# EAGLE design bike-blinky (EAGLE 6.4)
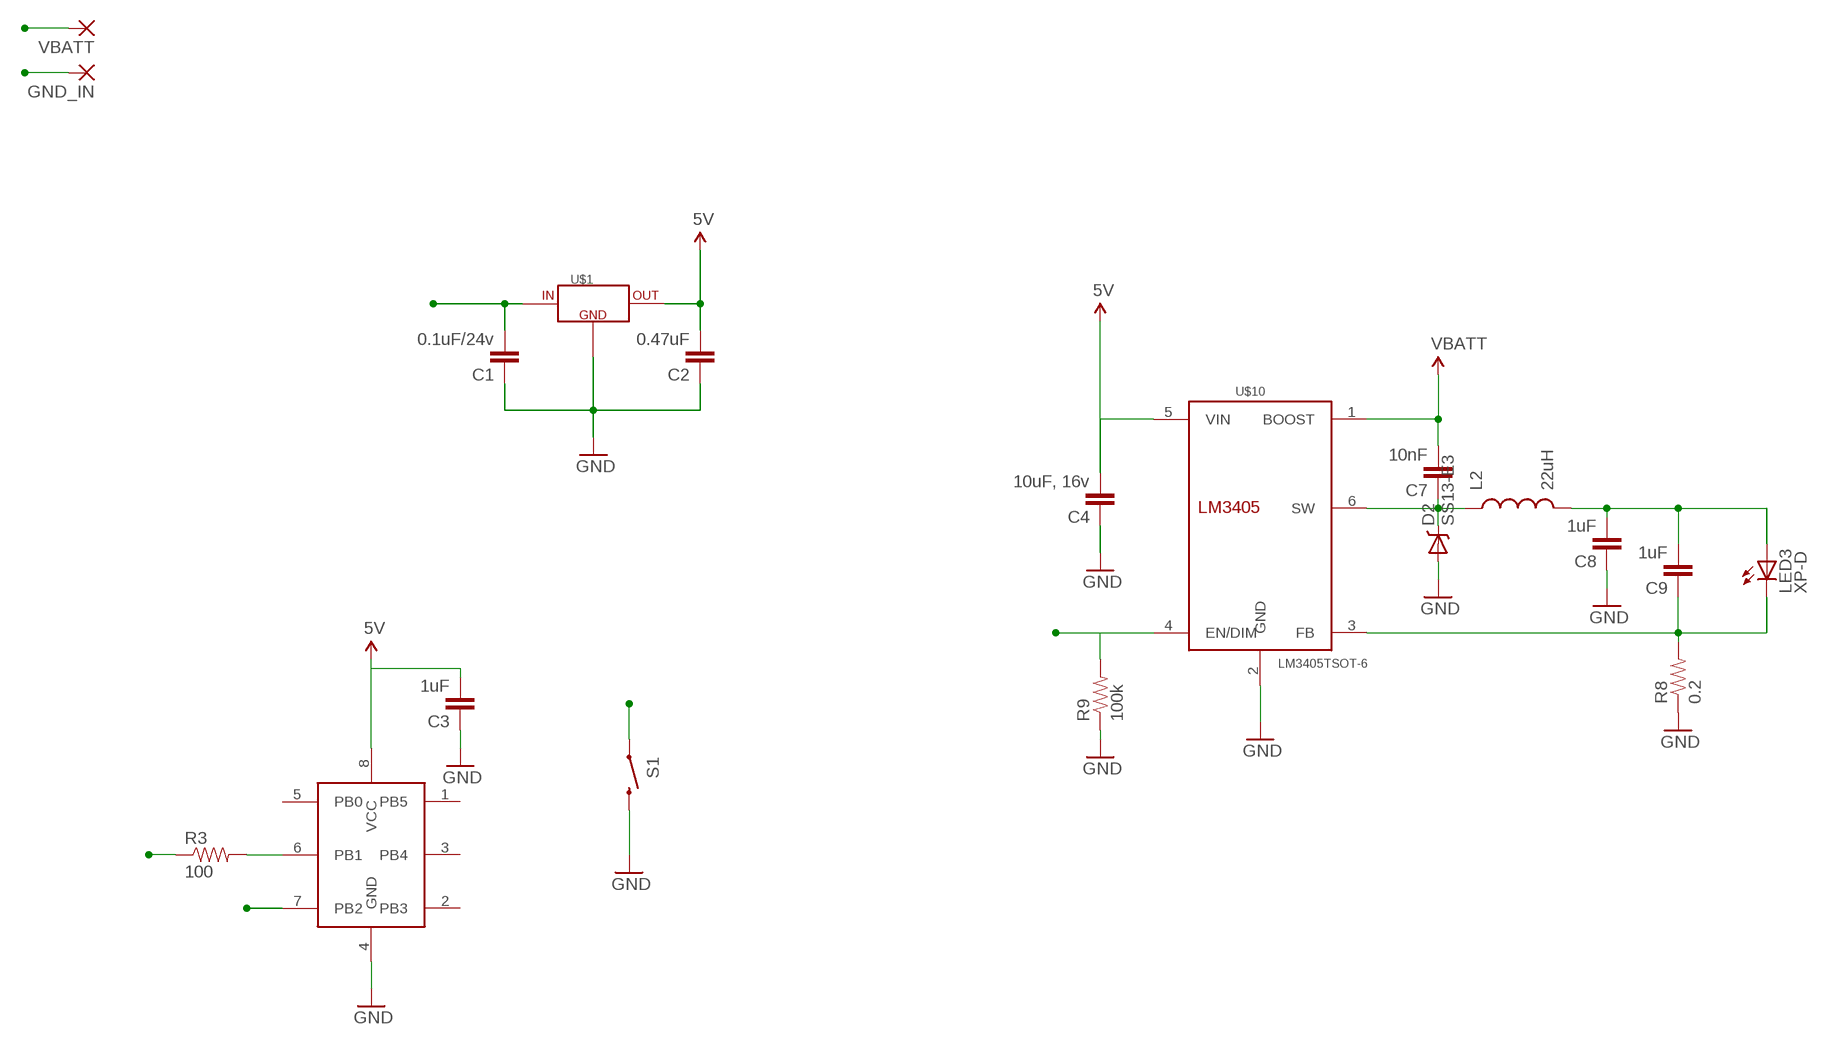
[diagram p0: schematic, sheet 1]

## Parts
C1  0.1uF/24v  CAP0603-CAP  [0603-CAP]
C2  0.47uF  CAP0603-CAP  [0603-CAP]
C3  1uF  CAP0603-CAP  [0603-CAP]
C4  10uF, 16v  CAP1206  [1206]
C7  10nF  CAP1206  [1206]
C8  1uF  CAP1206  [1206]
C9  1uF  CAP1206  [1206]
D2  SS13-E3  MBRA140  [SMA-DIODE]
GND_IN  WIREPAD2,54/1,0  [2,54/1,0]
L2  22uH  INDUCTOR1210  [1210]
LED3  XP-D  XLAMP-XB-D-LED  [XB-D-REV1]
R3  100  RESISTOR0603-RES  [0603-RES]
R8  0.2  RESISTOR2010  [R2010]
R9  100k  RESISTOR0603-RES  [0603-RES]
S1  SWITCH-MOMENTARY-2SMD-2  [TACTILE_SWITCH_SMD-2]
U$1  TPS715XX  [SC70-5]
U$2  ATTINY13  [WSOIC-8]
U$10  LM3405TSOT-6  [TSOT-6]
VBATT  WIREPAD2,54/1,0  [2,54/1,0]

## Nets
5V: C2.2 C3.2 C4.2 U$1.5(OUT) U$2.8(VCC) U$10.5(VIN)
GND: C1.1 C2.1 C3.1 C4.1 C8.1 D2.A GND_IN.1(P) R8.1 R9.1 S1.1 U$1.2(GND) U$2.4(GND) U$10.2(GND)
N$2: R3.2 U$2.6(PB1)
N$8: C9.1 LED3.C R8.2 U$10.3(FB)
N$12: C7.1 D2.C L2.1 U$10.6(SW)
N$13: C8.2 C9.2 L2.2 LED3.A
RED: R3.1 R9.2 U$10.4(EN/DIM)
SW: S1.2 U$2.7(PB2)
VBATT: C1.2 C7.2 U$1.4(IN) U$10.1(BOOST) VBATT.1(P)
Unconnected: U$2.1(PB5) U$2.2(PB3) U$2.3(PB4) U$2.5(PB0)

## Library data of the parts
C1-C4 = SparkFun:CAP: Capacitor Standard 0603 ceramic capacitor, and 0.1" leaded capacitor.
C7-C9 = SparkFun-Capacitors:CAP: Capacitor Standard 0603 ceramic capacitor, and 0.1" leaded capacitor.
D2 = SparkFun-DiscreteSemi:MBRA140: 40V, 1A Schottky rectifier SMA/DO-214AC package DIO-08053; PROD_ID: DIO-08053
GND_IN VBATT = wirepad:WIREPAD: Wire PAD connect wire on PCB
L2 = SparkFun-Passives:INDUCTOR: Inductors Basic Inductor/Choke - 0603 and 1206. Footprints are not proven and vary greatly between part numbers.
LED3 = led_cree:XLAMP-XB-D-LED
R3 = SparkFun:RESISTOR: Resistor Basic schematic elements and footprints for 0603, 1206, and PTH resistors.
R8 R9 = SparkFun-Passives:RESISTOR: Resistor Basic schematic elements and footprints for 0603, 1206, and PTH resistors.
S1 = SparkFun-Electromechanical:SWITCH-MOMENTARY-2: Various NO switches- pushbuttons, reed, etc
U$1 = Synapseware:TPS715XX: 50 mA, 24 V, 3.2-uA Supply Current Low-Dropout Linear Regulator in SC70 (SOT-323) Package TPS71550DCKR - 5.0V version TPS71533DCKR - 3.3V version TPS71525DCKR - 2.5V version
U$2 = Synapseware:ATTINY13
U$10 = Synapseware:LM3405: LM3405 1.6MHz, 1A Constant Current Buck Regulator for Powering LEDs

## Board
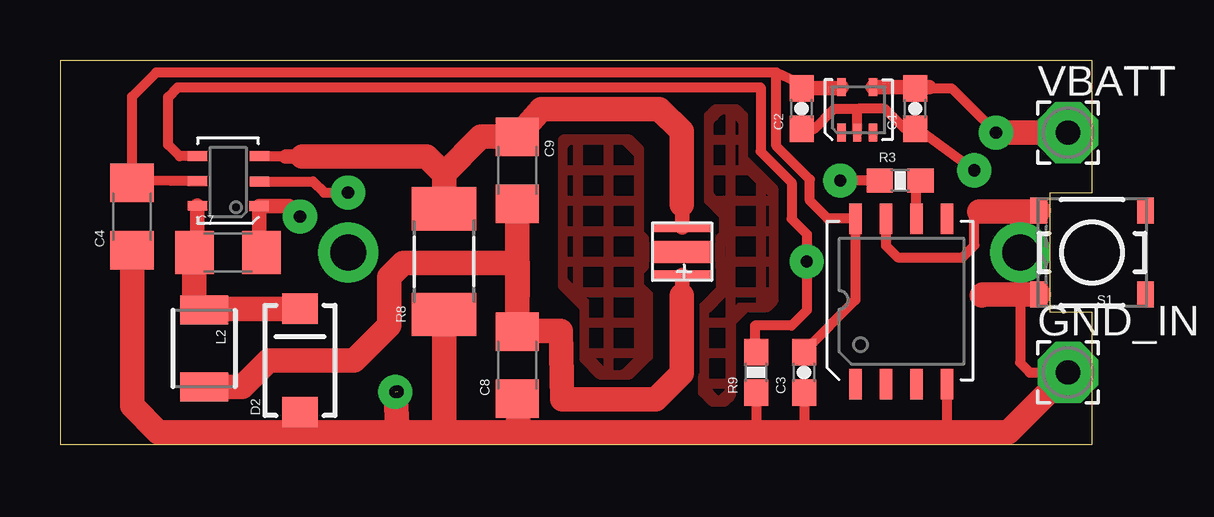
[diagram p1: board, top side]
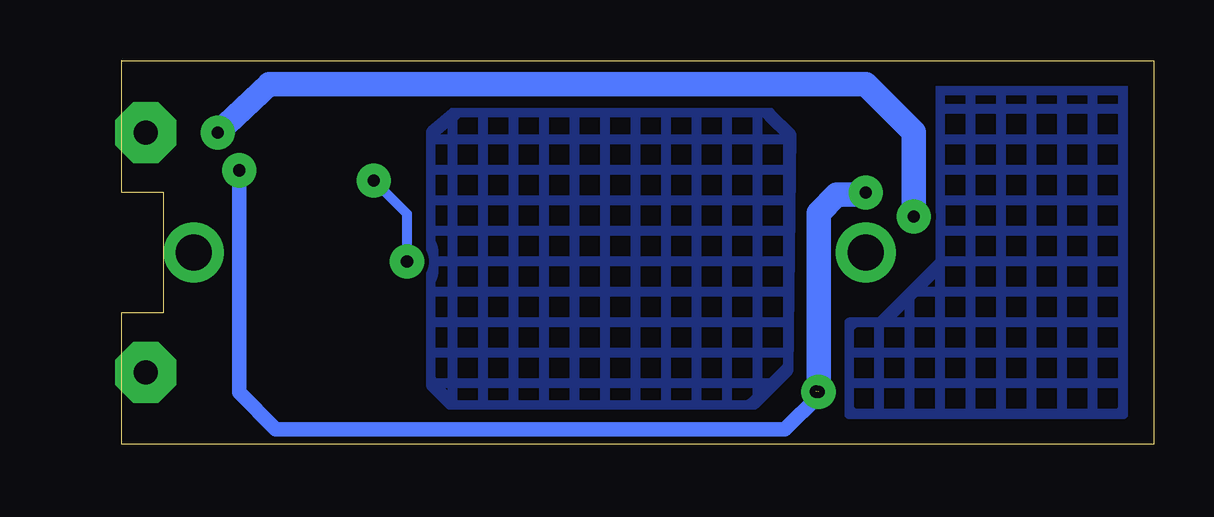
[diagram p2: board, bottom side, seen from below]

Size 43.02 x 16.01 mm. Coordinates in mm from the lower left corner, seen from the top.
Outline: 43,16 43,10.5 41.26,10.5 41.26,5.5 43,5.5 43,0 0,0 0,16 43,16
Outline: 43,16 43.02,16.01
Copper layers (1*16): Top 0.035mm / dielectric 1.5mm / Bottom 0.035mm
Design rules "default": minimum track width 10mil, minimum drill 24mil, track to track 8mil, track to pad 8mil, pad to pad 8mil, via to via 8mil, smd to smd 8mil, copper to edge 40mil, drill to drill 8mil, minimum pad ring 10mil, minimum via ring 8mil, stop-mask expansion 4mil, vias tented up to drill 0mil, thermal gap 10mil

### Footprints (pad centres in the part's own frame; a part is rotated, then mirrored left to right if it is on the bottom)
0603-CAP = smd 1.1 x 1: 1 -0.85,0; 2 0.85,0
1206 = smd 1.6 x 1.8: 1 -1.4,0; 2 1.4,0
SMA-DIODE = smd 1.27 x 1.47: A -2.15,0; C 2.15,0
2,54/1,0 = drill 1.016 pad 2.54 octagon: 1 0,0
1210 = smd 1.2 x 2: 1 -1.6,0; 2 1.6,0
XB-D-REV1 = smd 0.36 x 2.34: A 0.935,-0.075; C -1.035,-0.08 | smd 0.92 x 2.34: THERMAL -0.015,-0.075
0603-RES = smd 1.1 x 1: 1 -0.85,0; 2 0.85,0
R2010 = smd 1.8 x 2.7: 1 -2.2,0; 2 2.2,0
TACTILE_SWITCH_SMD-2 = smd 0.7 x 1.1: 1 2.225,1.75; 2 2.225,-1.75; 3 -2.225,-1.75; 4 -2.225,1.75
SC70-5 = smd 0.35 x 0.75: 1 -0.7,-1; 2 -0.05,-1; 3 0.6,-1; 4 0.6,0.9; 5 -0.7,0.9
WSOIC-8 = smd 0.508 x 1.27: 1 -1.855,-3.486; 2 -0.585,-3.486; 3 0.685,-3.486; 4 1.955,-3.486; 5 1.955,3.413; 6 0.685,3.413; 7 -0.585,3.413; 8 -1.855,3.413
TSOT-6 = smd 0.406 x 0.813: 1 -1.06,-1.3; 2 -0.04,-1.32; 3 1.02,-1.32; 4 1.02,1.27; 5 -0.02,1.27; 6 -1.05,1.28

### Placement (x,y rotation side)
C1  35.63,14 90 top
C2  30.91,14 90 top
C3  31,3 90 top
C4  3,9.5 90 top
C7  7,8 0 top
C8  19.05,3.3 90 top
C9  19.05,11.43 270 top
D2  10,3.5 90 top
GND_IN  42,3 0 top
L2  6,4 270 top
LED3  26,8 270 top
R3  35.01,11 0 top
R8  16,7.62 90 top
R9  29,3 90 top
S1  43,8 180 top
U$1  33.27,14 0 top
U$2  35,6 0 top
U$10  7,11 90 top
VBATT  42,13 0 top

### Tracks (layer width: path | path; a pad name or v marks a point on that pad's centre or on a via)
5V
  Top 0.406: U$10.5 4.62,10.98 3.4,11 C4.2 3,14.51 4,15.51 29.84,15.51 | C3.2 31,3.88 33.15,6.02 U$2.8 31.99,9.41 31.24,10.16 31.24,11.05 29.84,12.45 29.84,15.51 | 29.84,15.51 30.94,15 30.94,14.88 C2.2
  Top 0.61: C2.2 32.52,14.85 U$1.5
GND  (via drill 0.51, 0.51 pad 1.42)  (1 unrouted)
  Top 0.406: U$10.2 10.54,10.96 11,10.5 v12,10.5 | U$2.4 36.95,0.55 37,0.5 | R9.1 29,0.6 28.9,0.5 | C3.1 31,0.6 31.1,0.5 | S1.1 40.05,6.25 40,6.2 40,3.4 40.4,3 41.3,3 41.65,2.65 | C2.1 31.42,13.15 32.27,14 33.27,14 | U$1.2 33.22,13.95 33.27,14 | 33.27,14 34.37,14 35.22,13.15 C1.1 35.75,13.15 v38.1,11.43
  Top 1.016: GND_IN.1 41.65,2.65 39.5,0.5 37,0.5 31.1,0.5 28.9,0.5 19.11,0.5 | 19.11,0.5 16,0.5 | 16,0.5 14.08,0.5 | 14.08,0.5 9.95,0.5 | C8.1 19.11,0.5 | 9.95,0.5 D2.A | C4.1 3,1.6 4.1,0.5 9.95,0.5 | R8.1 16,0.5 | v13.97,2.18 14.08,0.5 | S1.1 38.45,6.25 38.4,6.2
  Bottom 0.406: v13.97,2.18 13.97,1.91
  Bottom 0.61: v38.1,11.43 38.1,2.16 36.58,0.64 15.37,0.64 13.97,2.03 v13.97,2.18
  Bottom 1.016: v13.97,2.18 13.97,9.65 13.21,10.41 12.09,10.41 v12,10.5
  other vias: 14.08,2.2
N$1  (via drill 1.5 pad 2.5)
  other vias: 40,8
N$2
  Top 0.406: U$2.6 35.69,10.81 35.5,11 R3.2
N$3
  pour Bottom (hatched): 15.24,3.05 16.64,1.65 29.34,1.65 30.1,2.41 30.1,13.08 29.21,13.84 16,13.84 15.11,12.95
N$4
  pour Bottom (hatched): 8.89,15.24 8.89,7.62 11.43,5.08 12.7,5.08 12.7,1.27 1.27,1.27 1.27,15.24
N$5
  pour Top (hatched): 20.95,12.7 20.95,6.6 21.84,5.71 21.84,3.56 22.48,2.92 23.75,2.92 24.51,3.68 24.51,6.22 24.13,6.6 24.13,7.24 24.51,7.62 24.51,8.38 24.13,8.76 24.13,12.32 23.75,12.7
N$6
  pour Top (hatched): 27.18,8.38 27.3,8.38 27.69,8.76 27.69,9.53 27.05,10.16 27.05,13.72 27.3,13.97 28.19,13.97 28.45,13.72 28.45,11.94 29.72,10.67 29.72,5.97 29.46,5.71 28.57,5.71 27.94,5.08 27.94,2.03 27.69,1.78 27.18,1.78 26.8,2.16 26.8,5.71 27.56,6.48 27.56,7.37 27.18,7.75 27.18,8.26
N$8
  Top 0.406: U$10.3 10.28,12.02 9.4,12
  Top 0.61: LED3.C 25.92,9.98 25.9,10 | 9.4,12 10.1,12
  Top 1.016: 25.9,10 25.9,13.06 24.97,13.99 20.05,13.99 C9.1 17.53,12.83 16,11.3 16,11.27 | 10.1,12 15.27,12 16,11.27 | 16,11.27 R8.2
N$11  (via drill 1.5 pad 2.5)
  other vias: 12,8
N$12
  Top 0.406: 5.72,8.12 C7.1
  Top 0.61: U$10.6 5.72,8.12
  Top 1.016: D2.C 6.05,5.65 L2.1 5.6,5.6 C7.1
N$13
  Top 0.61: LED3.A 25.93,6.22 25.9,6.2
  Top 1.016: 25.9,6.2 25.9,2.96 24.82,1.88 20.92,1.88 20.86,4.74 19.08,4.74 C8.2 | C9.2 C8.2 | L2.2 7.6,2.4 8.7,3.5 12.27,3.5 13.59,4.83 13.72,4.95 13.72,6.99 14.3,7.57 17.3,7.57 19.07,7.56 C8.2
RED  (via drill 0.51 pad 1.42)
  Top 0.406: U$10.4 4.98,12.02 4.5,12.5 4.5,14.49 4.9,14.89 29.19,14.89 29.19,12.21 30.48,10.92 30.48,9.4 31.11,8.76 v31.11,7.62 31.11,5.59 30.48,4.95 28.96,4.95 28.96,4.06 R9.2 | R3.1 v32.51,11
  Bottom 0.406: v31.11,7.62 31.11,9.61 v32.51,11
SW
  Top 0.406: U$2.7 34.41,8.29 34.9,7.8 37.6,7.8 38.1,8.3 38.1,9.5 38.3,9.7
  Top 1.016: 38.3,9.7 40.73,9.7 S1.2
VBATT  (via drill 0.51 pad 1.42)
  Top 0.406: 8.3,8.1 C7.2 | 9.56,9.94 v10,9.5 | C1.2 37.15,14.85 v39,13
  Top 0.61: 8.3,8.1 U$10.1 9.56,9.94 | U$1.4 36.22,14.9 C1.2
  Top 1.016: v39,13 VBATT.1
  Bottom 1.016: v10,9.5 10,13.02 12,15.02 36.86,15.02 v39,13